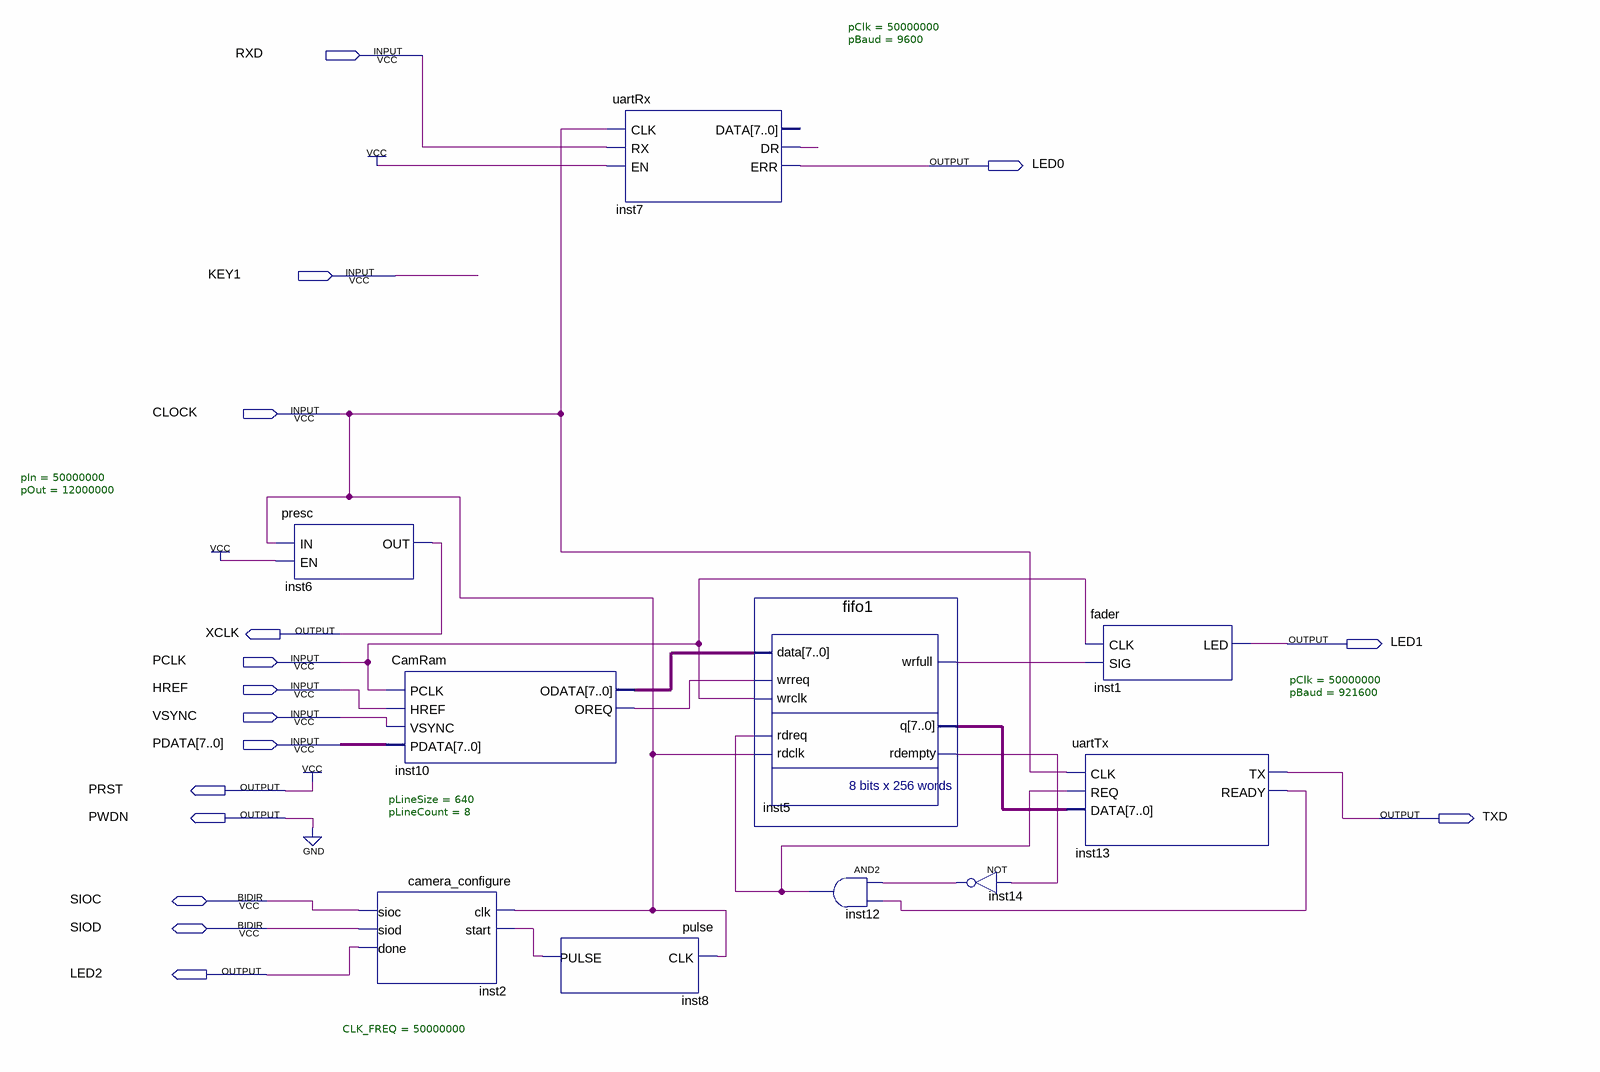
[diagram p0: schematic sheet]
// Quartus schematic fpgaflow.bdf as structural Verilog: 10 symbols, 16 pins
module fpgaflow (
  input  RXD,
  input  KEY1,
  input  CLOCK,
  input  PCLK,
  input  HREF,
  input  VSYNC,
  input  [7:0] PDATA,
  inout  SIOC,
  inout  SIOD,
  output LED0,
  output XCLK,
  output LED1,
  output PRST,
  output PWDN,
  output TXD,
  output LED2
);

  wire inst5_rdempty, inst5_wrfull, inst7_dr, inst8_pulse, inst10_oreq, inst12_out, inst13_ready, inst14_out;
  wire [7:0] inst5_q, inst10_odata;

  presc #(.pIn(50000000), .pOut(12000000)) inst6 (.IN(CLOCK), .EN(1'b1), .OUT(XCLK));
  CamRam #(.pLineSize(640), .pLineCount(8)) inst10 (
    .PCLK(PCLK), .HREF(HREF), .VSYNC(VSYNC), .PDATA(PDATA), .ODATA(inst10_odata), .OREQ(inst10_oreq));
  camera_configure #(.CLK_FREQ(50000000)) inst2 (
    .clk(CLOCK), .start(inst8_pulse), .sioc(SIOC), .siod(SIOD), .done(LED2));
  uartRx #(.pClk(50000000), .pBaud(9600)) inst7 (
    .CLK(CLOCK), .RX(RXD), .EN(1'b1), .DR(inst7_dr), .ERR(LED0));  // open: DATA
  pulse inst8 (.CLK(CLOCK), .PULSE(inst8_pulse));
  fifo1 inst5 (
    .data(inst10_odata), .wrreq(inst10_oreq), .wrclk(PCLK), .rdreq(inst12_out), .rdclk(CLOCK),
    .wrfull(inst5_wrfull), .q(inst5_q), .rdempty(inst5_rdempty));
  and inst12 (inst12_out, inst14_out, inst13_ready);
  not inst14 (inst14_out, inst5_rdempty);
  fader inst1 (.CLK(PCLK), .SIG(inst5_wrfull), .LED(LED1));
  uartTx #(.pClk(50000000), .pBaud(921600)) inst13 (
    .CLK(CLOCK), .REQ(inst12_out), .DATA(inst5_q), .TX(TXD), .READY(inst13_ready));

  assign PRST = 1'b1;
  assign PWDN = 1'b0;
endmodule
